# Altium schematic sheet LM386.SchDoc
size A4
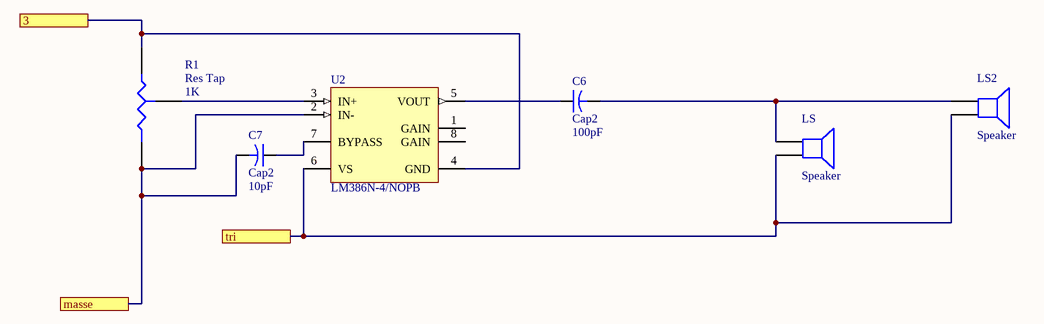
[diagram p0: LM386.SchDoc]

## Parts
C6  Cap2  value 100pF  [RB7.6-15]
C7  Cap2  value 10pF  [RB7.6-15]
LS  Speaker  [PIN2]
LS2  Speaker  [PIN2]
R1  Res Tap  value 1K  [VR3]
U2  LM386N-4/NOPB  [N08E]

## Ports
3, masse, tri

## Nets
3: R1.1(A) U2.4(GND) ; port 3
masse: C7.2 R1.2(B) U2.2(IN-) ; port masse
tri: LS.2 LS2.2 U2.6(VS) ; port tri
NetC6_1: C6.1 U2.5(VOUT)
NetC6_2: C6.2 LS.1 LS2.1
NetC7_1: C7.1 U2.7(BYPASS)
NetR1_3: R1.3(TAP) U2.3(IN+)

Not connected (* = marked no-connect by the designer): U2 1(GAIN) 8(GAIN)

## Library data of the parts
C6 C7 = Cap2: Capacitor; Published: 23-Sep-2002; PackageReference: CAPR5-4X5; Publisher: Altium Limited; PackageDescription: Capacitor; 2 Leads
LS LS2 = Speaker: Loudspeaker; Published: 24-Mar-1999; LatestRevisionDate: 17-Jul-2002; LatestRevisionNote: Re-released for DXP Platform.; PackageReference: PIN2; Publisher: Altium Limited
R1 = Res Tap: Tapped Resistor; Sim Note: Enter the Resistance value and the set point into parameter fields.; Set Position: 0.5; Published: 24-Mar-1999; LatestRevisionDate: 17-Jul-2002; LatestRevisionNote: Re-released for DXP Platform.; PackageReference: VR3; Publisher: Altium Limited; PackageDescription: Variable Resistor, Thru-Hole; 3 Leads
U2 = LM386N-4/NOPB: Low Voltage Audio Power Amplifier, 8-pin MDIP, Pb-Free; Manufacturer: National Semiconductor; PackageTopMarking: NSUZXYTTE#*LM*386N-4; PowerWise: N; CompType: Audio IC; Published: 1-Mar-2010; DatasheetVersion: Aug-2000; PackageVersion: revG, May-2006; PackageReference: N08E; Publisher: Altium Limited; PackageDescription: MDIP, .365 x .250 x .130in, 8 Lead, .100in Pitch; Supplier 1: Digi-Key; Supplier Part Number 1: LM386N-4-ND; Supplier 2: Farnell; Supplier Part Number 2: 1184987; PartNumber: LM386N-4/NOPB; RoHS: Y; PinCount: 8; Code_JEDEC: MS-001-BA; ComponentLink1Description: LM386 Datasheet; ComponentLink1URL: http://www.national.com/ds/LM/LM386.pdf; ComponentLink2Description: LM386 Web Page; ComponentLink2URL: http://www.national.com/pf/LM/LM386.html; ComponentLink3Description: N08E Package Page; ComponentLink3URL: http://www.national.com/packaging/folders/n08e.html